# EAGLE design Main_Board_Rev_0.1 (EAGLE 8.4.0)
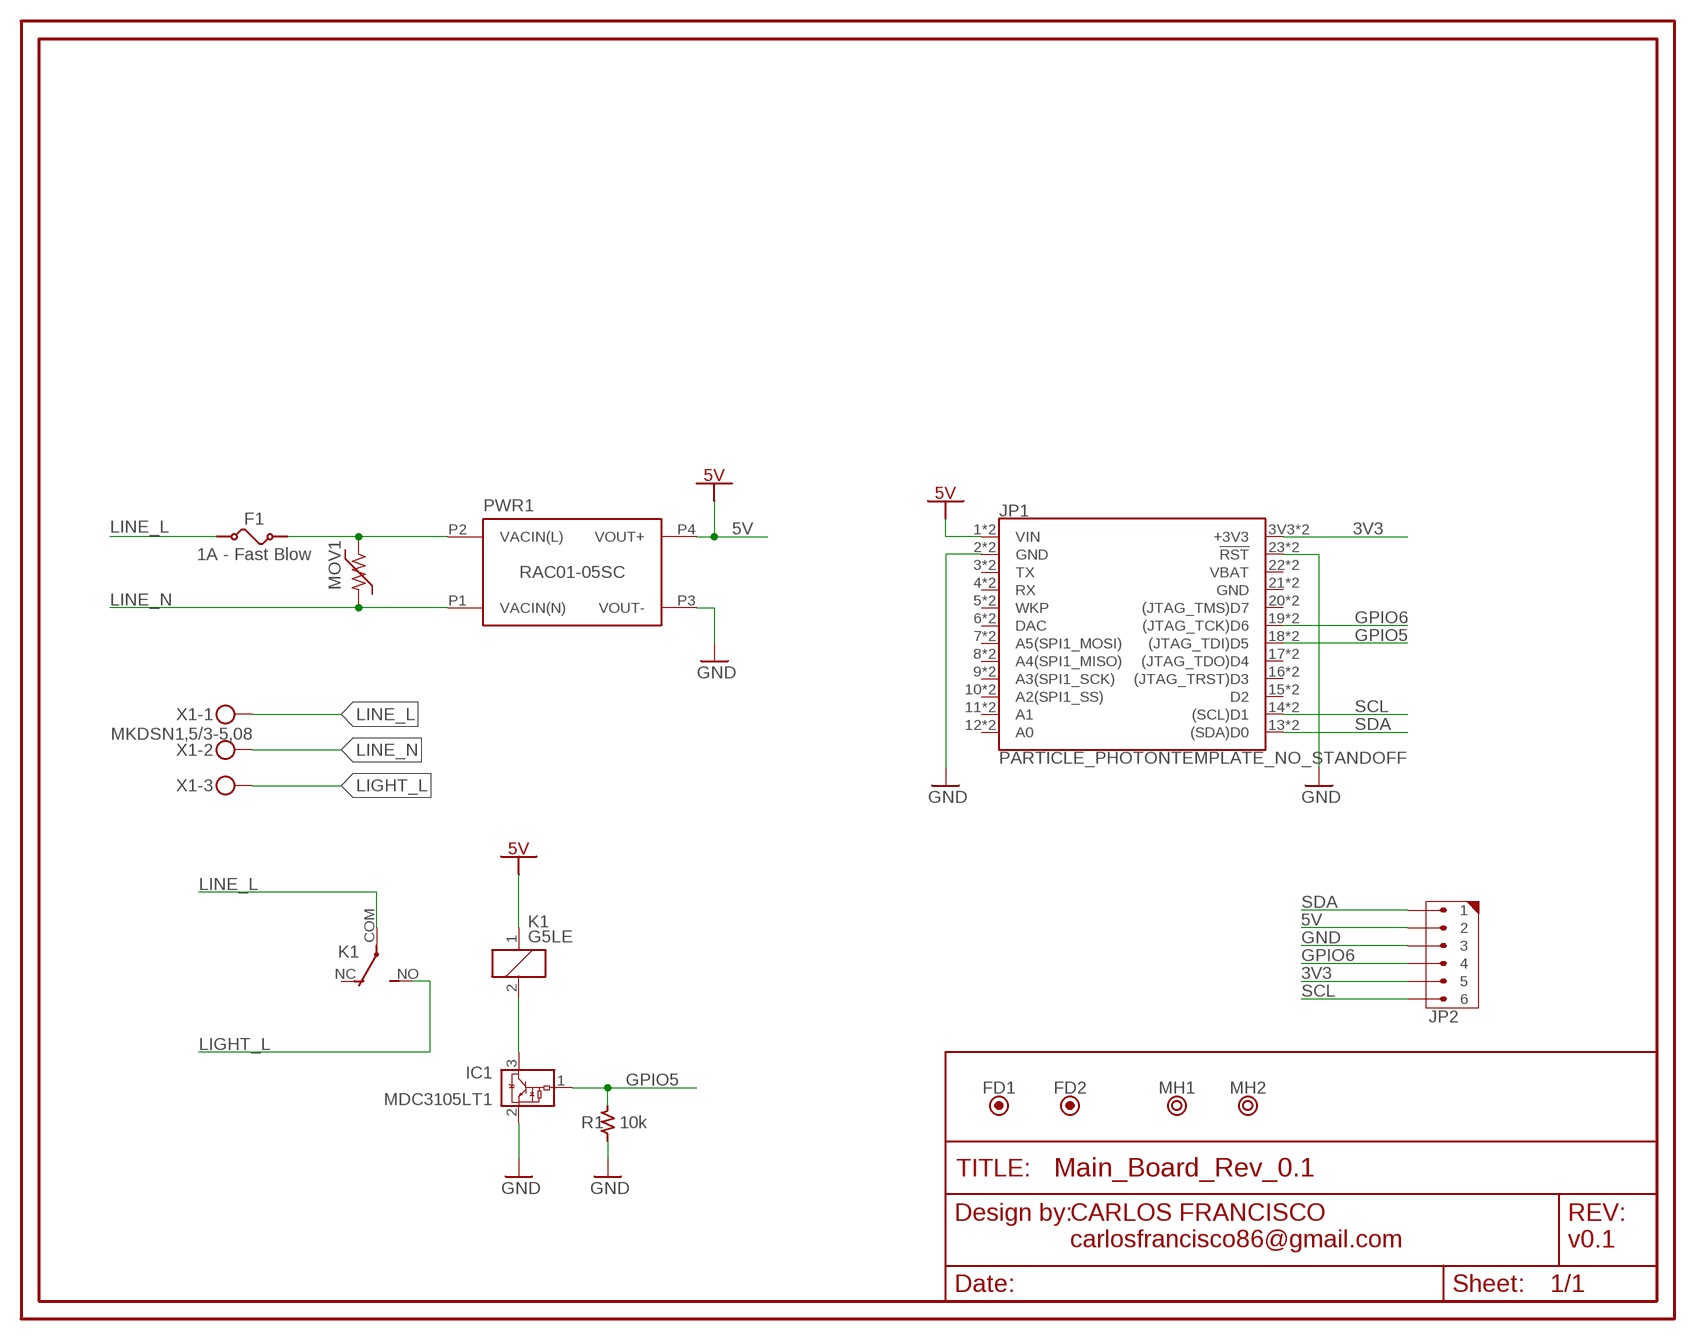
[diagram p0: schematic, sheet 1]

## Parts
F1  1A - Fast Blow  FUSE0.1A-7A  [FUSE3.6X10MM]
FD1  FIDUCIALBFID  [BOARD_FIDUCIAL]
FD2  FIDUCIALBFID  [BOARD_FIDUCIAL]
IC1  MDC3105LT1  [SOT23]
JP1  PARTICLE_PHOTONTEMPLATE_NO_STANDOFF  [PARTICLE_PHOTON_TEMPLATE_NO_STANDOFF]
JP2  6X1THT_254MM  [HDRV6W63P254_6X1_1520X280H680]
K1  G5LE  [G5LE]
MH1  MOUNTING_HOLE3.5MM  [MTGP500H350]
MH2  MOUNTING_HOLE3.5MM  [MTGP500H350]
MOV1  MOV-ROV10H_P  [ROV10H_P]
PWR1  RAC01-05SC  [LOW_PROFILE_POWER_MODULE]
R1  10k  R_THICKFILM2012  [RESC2012X60L35N]
X1  MKDSN1,5/3-5,08  [MKDSN1,5/3-5,08]

## Nets
3V3: JP1.3V3(+3V3) JP1.24(+3V3) JP2.5
5V: JP1.1(VIN) JP1.VIN JP2.2 K1.1 PWR1.P4(VOUT+)
GND: IC1.2(GND) JP1.2(GND) JP1.23(!RST!) JP1.GND@0(GND) JP1.RST(!RST!) JP2.3 PWR1.P3(VOUT-) R1.1
GPIO5: IC1.1(VIN) JP1.18((JTAG_TDI)D5) JP1.D5((JTAG_TDI)D5) R1.2
GPIO6: JP1.19((JTAG_TCK)D6) JP1.D6((JTAG_TCK)D6) JP2.4
LIGHT_L: K1.NO(2:S) X1.3
LINE_L: F1.P$1 K1.COM(2:P) X1.1
LINE_L_F: F1.P$2 MOV1.2 PWR1.P2(VACIN(L))
LINE_N: MOV1.1 PWR1.P1(VACIN(N)) X1.2
N$5: IC1.3(VOUT) K1.2
SCL: JP1.14((SCL)D1) JP1.D1((SCL)D1) JP2.6
SDA: JP1.13((SDA)D0) JP1.D0((SDA)D0) JP2.1
Unconnected: JP1.3(TX) JP1.4(RX) JP1.5(WKP) JP1.6(DAC) JP1.7(A5(SPI1_MOSI)) JP1.8(A4(SPI1_MISO)) JP1.9(A3(SPI1_SCK)) JP1.10(A2(SPI1_SS)) JP1.11(A1) JP1.12(A0) JP1.15(D2) JP1.16((JTAG_TRST)D3) JP1.17((JTAG_TDO)D4) JP1.20((JTAG_TMS)D7) JP1.A0 JP1.A1 JP1.A2(A2(SPI1_SS)) JP1.A3(A3(SPI1_SCK)) JP1.A4(A4(SPI1_MISO)) JP1.A5(A5(SPI1_MOSI)) JP1.D2 JP1.D3((JTAG_TRST)D3) JP1.D4((JTAG_TDO)D4) JP1.D7((JTAG_TMS)D7) JP1.DAC JP1.RX JP1.TX JP1.WKP K1.NC(2:O) MH1.1 MH2.1

## Notes on the sheet
- CARLOS FRANCISCO
  carlosfrancisco86@gmail.com
- v0.1

## Power pins joined to a net without a drawn wire
GND: JP1.21(GND) JP1.GND@2(GND)
VBAT: JP1.22(VBAT) JP1.VBAT

## Library data of the parts
F1 = Mtronik-protection:FUSE
FD1 FD2 = Mtronik-Aesthetics:FIDUCIAL: FIDUCIAL Symbol
IC1 = on-semiconductor:MDC3105LT1: Integrated Relay, Inductive Load Driver Sopurce: U6 OnSemi Inductive Load Driver MDC3105-D.PDF; MF: ON SEMICONDUCTOR; MPN: MDC3105LT1; OC_FARNELL: 1126459; OC_NEWARK: 16F6132
JP1 = SparkFun-Boards:PARTICLE_PHOTON: Particle Photon Footprint of the Particle Photon that is used as a basis for many Photon shields. SparkFun Products: Particle Photon <https://www.sparkfun.com/products/13764> SparkFun Photon ProtoShield <https://www.sparkfun.com/products/13598> SparkFun Photon micro OLED Shield <https://www.sparkfun.com/products/13628> SparkFun Photon IMU Shield <https://www.sparkfun.com/products/13629> SparkFun Photon Battery Shield <https://www.sparkfun.com/products/13626>
JP2 = Mtronik-connector:6X1
K1 = RealyChange:G5LE: RELAY 1 x switch, 10 A/120 V AC, 8 A/30 V DC, Omron; OC_FARNELL: unknown; OC_NEWARK: unknown
MH1 MH2 = Mtronik-Aesthetics:MOUNTING_HOLE: MOUNTING HOLE Symbol
MOV1 = supressor:MOV-: MOV (Metal Oxide Varistor)
PWR1 = recom-powerline-acdc-converters:RAC*SC: RECOM POWERLINE AC/DC-Converter (RAC01-SC and RAC02-SC series) The RAC01-SC and RAC02-SC series are ultra-compact universal input AC/DC power modules for PCB mounting. They feature high efficiency, low standby power, high operating temperature, soft start and short-circuit protection as well as a built-in EMC Class B filter. Output voltages range from 3.3VDC to 24VDC. Datasheet <http://www.recom-power.com/pdf/Powerline-AC-DC/RAC01_02-SC.pdf>; INPUT_RANGE: 80 - 277 (VAC); MAX_CAPACITIVE_LOAD: 1000uF; OUTPUT_CURRENT: 200mA; OUTPUT_VOLTAGE: 5v
R1 = Mtronik-passives:R_THICKFILM: Thick Film Resistor IPC7351C Compliant Package: 0402 (Metric) / 01005 (Inches) Package: 0603 (Metric) / 0201 (Inches) Package: 1005 (Metric) / 0402 (Inches) Package: 1608 (Metric) / 0603 (Inches) Package: 2012 (Metric) / 0805 (Inches) Package: 3216 (Metric) / 1206 (Inches) Package: 3225 (Metric) / 1210 (Inches)
X1 = con-phoenix-508:MKDSN1,5/3-5,08: MKDSN 1,5/ 3-5,08 Printklemme Nennstrom: 13,5 A Nennspannung: 250 V Rastermaß: 5,08 mm Polzahl: 3 Anschlussart: Schraubanschluss Montage: Löten Anschlussrichtung Leiter/Platine: 0 ° Artikelnummer: 1729131 Source: http://eshop.phoenixcontact.com .. 1729131.pdf

## Board
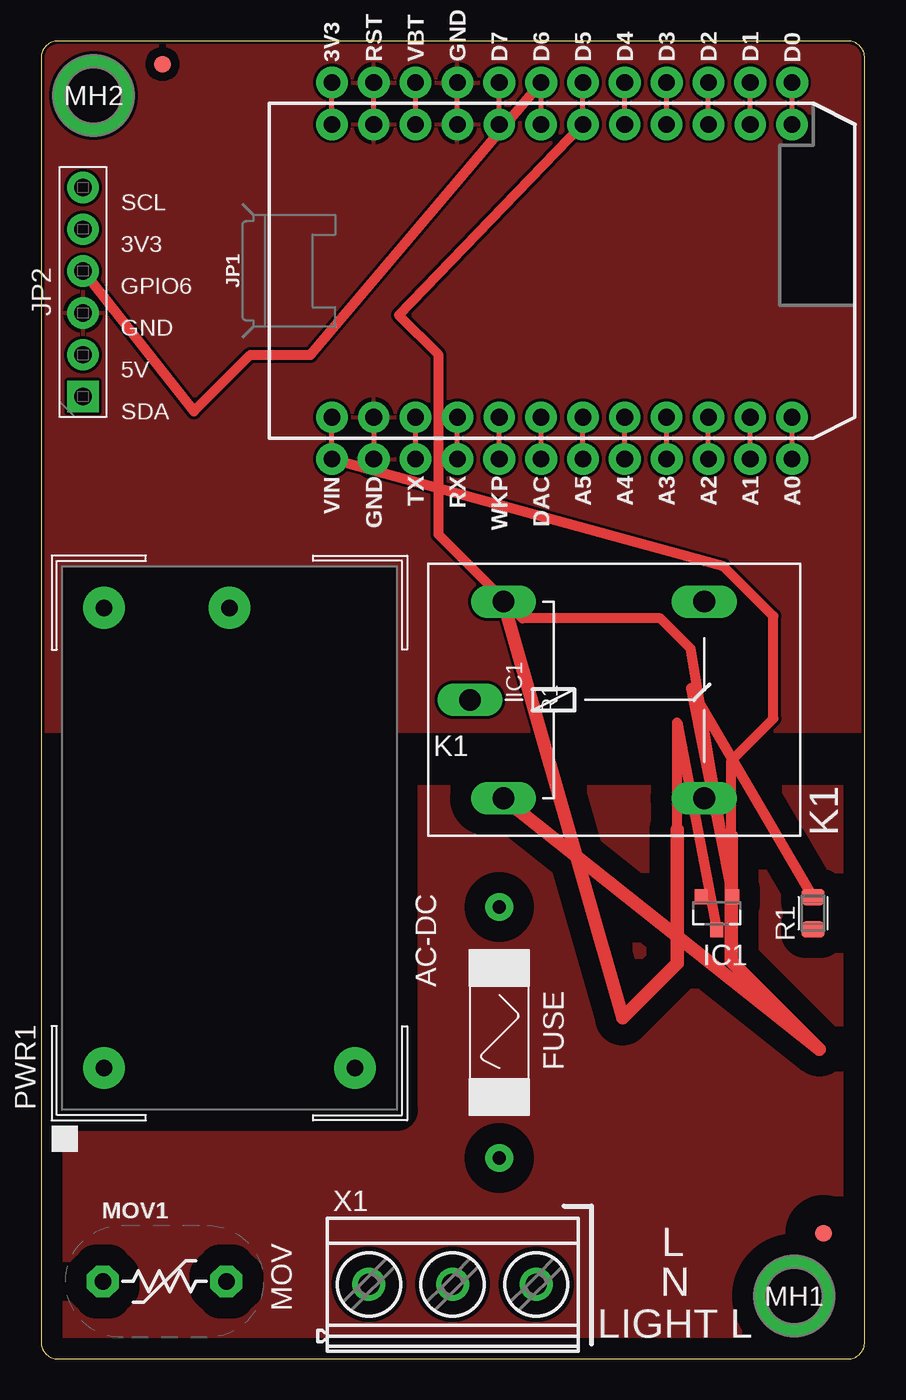
[diagram p1: board, top side]
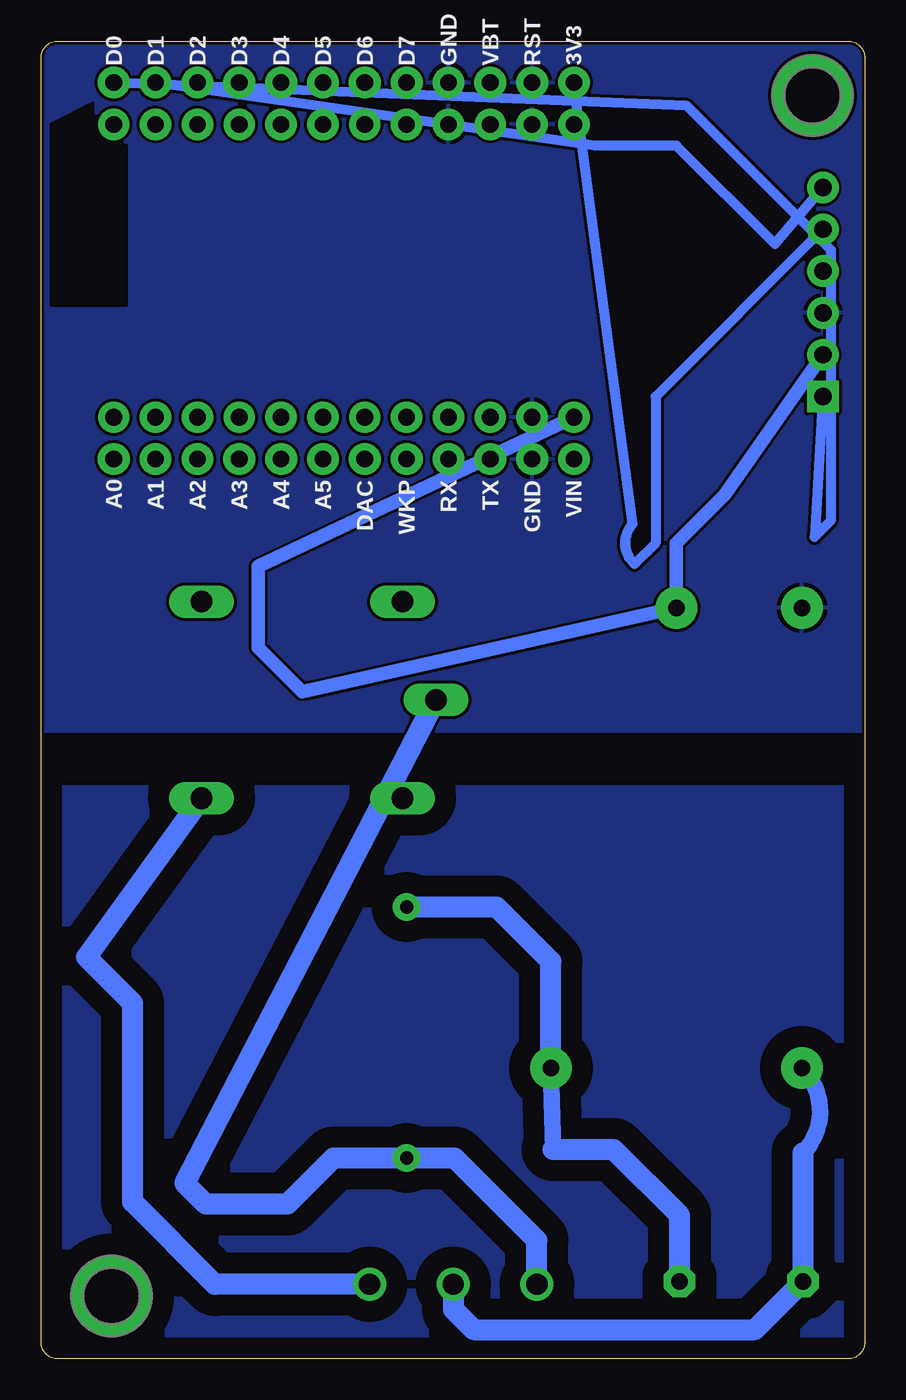
[diagram p2: board, bottom side, seen from below]

Size 50 x 80 mm. Coordinates in mm from the lower left corner, seen from the top.
Outline: 0,79 0,1 arc90 1,0 49,0 arc90 50,1 50,79 arc90 49,80 1,80 arc90 0,79
Copper layers (1*16): Top 0.035mm / dielectric 1.5mm / Bottom 0.035mm
Design rules "SparkFun-2-layer-TIGHT": minimum track width 7mil, minimum drill 15mil, track to track 7mil, track to pad 7mil, pad to pad 7mil, via to via 7mil, smd to smd 7mil, copper to edge 7mil, drill to drill 7mil, minimum pad ring 7mil, minimum via ring 7mil, stop-mask expansion 4mil, vias tented up to drill 25mil, thermal gap 10mil

### Footprints (pad centres in the part's own frame; a part is rotated, then mirrored left to right if it is on the bottom)
FUSE3.6X10MM = drill 0.8 pad 1.676: P$1 -7.62,0; P$2 7.62,0
BOARD_FIDUCIAL = smd 1 x 1: FID1 0,0
SOT23 = smd 0.8 x 0.9: 1 -0.95,-1; 2 0.95,-1; 3 0,1
PARTICLE_PHOTON_TEMPLATE_NO_STANDOFF = drill 1.016 pad 1.905: 1 -8.89,12.7; 2 -8.89,10.16; 3 -8.89,7.62; 4 -8.89,5.08; 5 -8.89,2.54; 6 -8.89,0; 7 -8.89,-2.54; 8 -8.89,-5.08; 9 -8.89,-7.62; 10 -8.89,-10.16; 11 -8.89,-12.7; 12 -8.89,-15.24; 13 8.89,-15.24; 14 8.89,-12.7; 15 8.89,-10.16; 16 8.89,-7.62; 17 8.89,-5.08; 18 8.89,-2.54; 19 8.89,0; 20 8.89,2.54; 21 8.89,5.08; 22 8.89,7.62; 23 8.89,10.16; 24 8.89,12.7 | drill 1.016 pad 1.93: 3V3 11.43,12.7; A0 -11.43,-15.24; A1 -11.43,-12.7; A2 -11.43,-10.16; A3 -11.43,-7.62; A4 -11.43,-5.08; A5 -11.43,-2.54; D0 11.43,-15.24; D1 11.43,-12.7; D2 11.43,-10.16; D3 11.43,-7.62; D4 11.43,-5.08; D5 11.43,-2.54; D6 11.43,0; D7 11.43,2.54; DAC -11.43,0; GND@0 -11.43,10.16; GND@2 11.43,5.08; RST 11.43,10.16; RX -11.43,5.08; TX -11.43,7.62; VBAT 11.43,7.62; VIN -11.43,12.7; WKP -11.43,2.54
HDRV6W63P254_6X1_1520X280H680 = drill 1.05 pad 1.9 square: 1 0,0 | drill 1.05 pad 1.9: 2 2.54,0; 3 5.08,0; 4 7.62,0; 5 10.16,0; 6 12.7,0
G5LE = drill 1.321 long: 1 -7.493,-5.969; 2 -7.493,5.969; COM -9.525,0; NC 4.699,5.969; NO 4.699,-5.969
MTGP500H350 = drill 3.5 pad 5: 1 0,0
ROV10H_P = drill 1 pad 1.93 octagon: 1 -3.75,0; 2 3.75,0
LOW_PROFILE_POWER_MODULE = drill 1 pad 2.54: P1 -12.7,7.62; P2 -12.7,-7.62; P3 15.24,7.62; P4 15.24,0
RESC2012X60L35N = smd 0.96 x 1.38: 1 -0.98,0; 2 0.98,0
MKDSN1,5/3-5,08 = drill 1.3 pad 2: 1 -7.641,0.025; 2 -2.561,0.025; 3 2.519,0.025

### Placement (x,y rotation side)
F1  27.81,19.81 90 top
FD1  47.5,7.62 0 top
FD2  7.37,78.61 0 top
IC1  41.02,27.05 180 top
JP1  30.35,66.06 90 top
JP2  2.54,58.42 90 top
K1  35.56,40.01 0 top
MH1  45.72,3.81 0 top
MH2  3.17,76.71 0 top
MOV1  7.49,4.7 0 top
PWR1  11.43,30.35 90 top
R1  46.86,27.05 90 top
X1  27.54,4.5 0 top

### Tracks (layer width: path | path; a pad name or v marks a point on that pad's centre or on a via)
3V3
  Bottom 0.61: JP2.5 12.7,58.42 12.7,49.53 13.97,48.26 arc90 14.1,50.67 JP1.3V3
5V
  Top 0.61: JP1.VIN 41.4,48.13 44.45,45.09 44.45,38.86 41.91,36.32 41.91,31.75
  Top 0.813: K1.1 47.24,18.8 41.91,24.13 41.91,31.75
  Bottom 0.813: JP1.1 36.83,48.11 36.83,43.18 34.16,40.51 PWR1.P4 11.43,49.53 8.51,52.45 JP2.2
GND
  pour Bottom: 50.04,38.1 50.04,79.01 arc90 49.04,80.01 1,80.01 arc90 0,79.01 0,38.1
  pour Top: 0,38.1 0,79.01 arc-90 1,80.01 49.04,80.01 arc-90 50.04,79.01 50.04,38.1
GPIO5
  Top 0.61: JP1.18 21.72,63.37 24.13,60.96 24.13,50.04 29.21,44.96 37.59,44.96 39.43,43.12 IC1.1 39.45,40.73 R1.2
GPIO6
  Top 0.61: JP2.4 9.27,57.53 12.7,60.96 16.36,60.96 JP1.D6
LIGHT_L
  Bottom 1.27: K1.NO 47.24,24.38 44.45,21.59 44.45,9.53 39.45,4.53 X1.3
LINE_L
  Bottom 1.27: X1.1 19.9,7.2 24.89,12.19 F1.P$1 32.26,12.19 35.05,9.4 40.01,9.4 41.27,10.67 K1.COM
LINE_L_F
  Bottom 1.016: 18.92,12.7 PWR1.P2
  Bottom 1.27: MOV1.2 11.24,8.7 15.24,12.7 18.92,12.7 | PWR1.P2 19.05,24.13 22.35,27.43 F1.P$2
LINE_N
  Bottom 1.016: PWR1.P1 arc90 3.74,12.51
  Bottom 1.27: 3.74,12.51 MOV1.1 6.66,1.78 23.75,1.78 24.98,3.01 X1.2
N$1
  pour Bottom (isolate 1.27): 0.13,34.54 0,1 arc90 1,0 48.53,0 arc90 49.53,1 49.66,34.54
  pour Top (isolate 1.27): 49.4,34.54 49.53,1 arc-90 48.53,0 1,0 arc-90 0,1 -0.13,34.54
N$5
  Top 0.61: 38.61,32.13 38.61,38.62 IC1.3
  Top 0.813: 38.61,32.13 38.61,24 35.31,20.7 K1.2
SCL
  Bottom 0.61: JP2.6 5.46,67.69 11.43,73.66 16.36,73.66 JP1.D1
SDA
  Bottom 0.61: JP2.1 3.05,49.91 2.03,50.93 2.03,67.31 10.79,76.07 JP1.D0

### Text on the board
tPlace: SCL | 3V3 | GPIO6 | GND | 5V | SDA | IC1 | R1 | K1 | AC-DC | FUSE | L | MOV | N | LIGHT L